# EAGLE schematic schematicEagle (EAGLE 9.6.2)
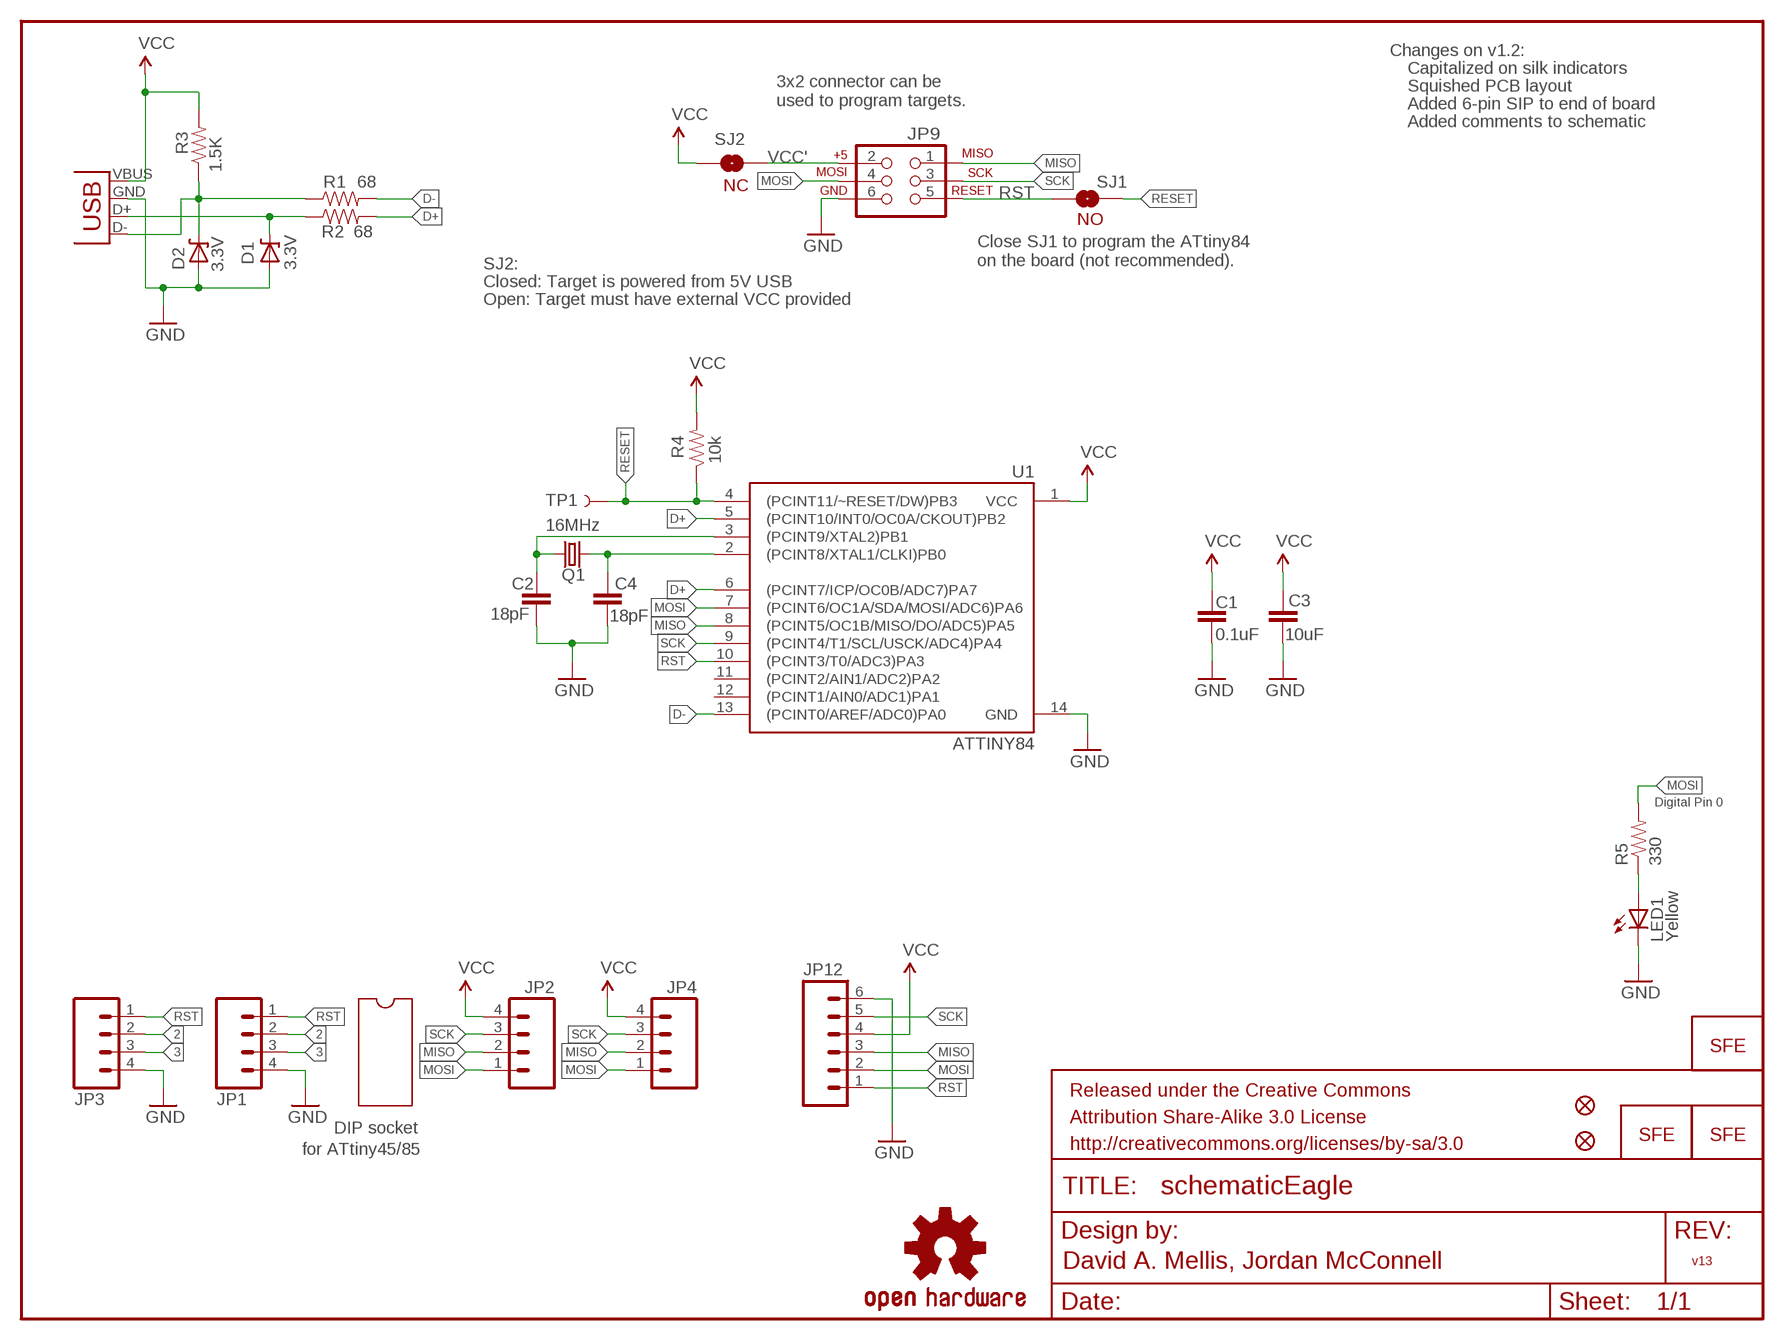
[diagram p0: schematic, sheet 1]

## Parts
C1  0.1uF  CAP0402-CAP  [0402-CAP]
C2  18pF  CAP0402-CAP  [0402-CAP]
C3  10uF  CAP0402-CAP  [0402-CAP]
C4  18pF  CAP0402-CAP  [0402-CAP]
D1  3.3V  DIODE-ZENER-BZT52  [SOD-323]
D2  3.3V  DIODE-ZENER-BZT52  [SOD-323]
FRAME1  FRAME-LETTER  [CREATIVE_COMMONS]
JP1  M04PTH  [1X04]
JP2  M04PTH  [1X04]
JP3  M04SMD_STRAIGHT_COMBO  [1X04_SMD_STRAIGHT_COMBO]
JP4  M04SMD_STRAIGHT_COMBO  [1X04_SMD_STRAIGHT_COMBO]
JP5  LOGO-SFENW2  [SFE-NEW-WEB]
JP6  LOGO-SFESK  [SFE-LOGO-FLAME]
JP7  FIDUCIALUFIDUCIAL  [MICRO-FIDUCIAL]
JP8  FIDUCIALUFIDUCIAL  [MICRO-FIDUCIAL]
JP9  AVR_SPI_PRG_6PTH  [2X3]
JP11  LOGO-SFESK  [SFE-LOGO-FLAME]
JP12  M06SIP  [1X06]
LED1  Yellow  LED0603  [LED-0603]
Q1  16MHz  CRYSTAL5X3  [CRYSTAL-SMD-5X3]
R1  68  RESISTOR0402-RES  [0402-RES]
R2  68  RESISTOR0402-RES  [0402-RES]
R3  1.5K  RESISTOR0402-RES  [0402-RES]
R4  10k  RESISTOR0402-RES  [0402-RES]
R5  330  RESISTOR0402-RES  [0402-RES]
SJ1  SOLDERJUMPERNO  [SJ_2S-NO]
SJ2  NC  SOLDERJUMPERNC  [SJ_2S]
TP1  TEST-POINT3  [PAD.03X.03]
U1  ATTINY84  [SO14]
U$1  OSHW-LOGOS  [OSHW-LOGO-S]
X1  USB-A-H  [USB-A-H]

## Nets
2: JP1.2 JP3.2
3: JP1.3 JP3.3
D+: R2.2 U1.5((PCINT10/INT0/OC0A/CKOUT)PB2) U1.6((PCINT7/ICP/OC0B/ADC7)PA7)
D-: R1.2 U1.13((PCINT0/AREF/ADC0)PA0)
GND: C1.2 C2.2 C3.2 C4.2 D1.2(A) D2.2(A) JP1.4 JP3.4 JP9.6 JP12.6 LED1.C U1.14(GND) X1.GND(VBUS)
MISO: JP2.2 JP4.2 JP9.1 JP12.3 U1.8((PCINT5/OC1B/MISO/DO/ADC5)PA5)
MOSI: JP2.1 JP4.1 JP9.4 JP12.2 R5.2 U1.7((PCINT6/OC1A/SDA/MOSI/ADC6)PA6)
N$1: D2.1(C) R1.1 R3.1 X1.D-(D+)
N$2: D1.1(C) R2.1 X1.D+(D-)
N$3: C2.1 Q1.3 U1.3((PCINT9/XTAL2)PB1)
N$4: C4.1 Q1.1 U1.2((PCINT8/XTAL1/CLKI)PB0)
N$5: LED1.A R5.1
RESET: R4.1 SJ1.1 TP1.P$1 U1.4((PCINT11/~RESET/DW)PB3)
RST: JP1.1 JP3.1 JP9.5 JP12.1 SJ1.2 U1.10((PCINT3/T0/ADC3)PA3)
SCK: JP2.3 JP4.3 JP9.3 JP12.5 U1.9((PCINT4/T1/SCL/USCK/ADC4)PA4)
VCC: C1.1 C3.1 JP2.4 JP4.4 JP12.4 R3.2 R4.2 SJ2.1 U1.1(VCC) X1.VBUS(GND)
VCC': JP9.2 SJ2.2
Unconnected: U1.11((PCINT2/AIN1/ADC2)PA2) U1.12((PCINT1/AIN0/ADC1)PA1)

## Notes on the sheet
- Changes on v1.2:
- Capitalized on silk indicators
- Squished PCB layout
- 3x2 connector can be
  used to program targets.
- Added 6-pin SIP to end of board
- Added comments to schematic
- NC
- NO
- Close SJ1 to program the ATtiny84
  on the board (not recommended).
- SJ2:
- Closed: Target is powered from 5V USB
- Open: Target must have external VCC provided
- Digital Pin 0
- DIP socket
- for ATtiny45/85
- v13
- David A. Mellis, Jordan McConnell

## Library data of the parts
C1-C4 = SparkFun-Passives:CAP: Capacitor Standard 0603 ceramic capacitor, and 0.1" leaded capacitor.
D1 D2 = SparkFun-DiscreteSemi:DIODE-ZENER: Zener Diode Production Part - 8199 3.4V Zener Voltage
FRAME1 = SparkFun-Aesthetics:FRAME-LETTER: Schematic Frame Standard 8.5x11 US Letter frame
JP1-JP4 = SparkFun-Connectors:M04: Header 4 Standard 4-pin 0.1" header. Use with straight break away headers (SKU : PRT-00116), right angle break away headers (PRT-00553), swiss pins (PRT-00743), machine pins (PRT-00117), and female headers (PRT-00115). Molex polarized connector foot print use with SKU : PRT-08231 with associated crimp pins and housings. 1MM SMD Version SKU: PRT-10208
JP5 JP6 JP11 = SparkFun-Aesthetics:LOGO-SFE: Spark Fun Electronics PCB Logo This is the standard Spark Fun Electronics PCB logo.
JP7 JP8 = SparkFun:FIDUCIAL: Fiducial Alignment Points Various fiducial points for machine vision alignment.
JP9 = SparkFun-Connectors:AVR_SPI_PRG_6: AVR ISP 6 Pin This is the reduced ISP connector for AVR programming. Common on Arduino. This footprint will take up less PCB space and can be used with a 10-pin to 6-pin adapter such as SKU: BOB-08508
JP12 = SparkFun-Connectors:M06: Header 6 Standard 6-pin 0.1" header. Use with straight break away headers (SKU : PRT-00116), right angle break away headers (PRT-00553), swiss pins (PRT-00743), machine pins (PRT-00117), and female headers (PRT-00115). Molex polarized connector foot print use with SKU : PRT-08094 with associated crimp pins and housings. NOTES ON THE VARIANTS LOCK and LOCK_LONGPADS... This footprint was designed to help hold the alignment of a through-hole component (i.e. 6-pin header) while soldering it into place. You may notice that each hole has been shifted either up or down by 0.005 of an inch from it's more standard position (which is a perfectly straight line). This slight alteration caused the pins (the squares in the middle) to touch the edges of the holes. Because they are alternating, it causes a "brace" to hold the component in place. 0.005 has proven to be the perfect amount of "off-center" position when using our standard breakaway headers. Although looks a little odd when you look at the bare footprint, once you have a header in there, the alteration is very hard to notice. Also,if you push a header all the way into place, it is covered up entirely on the bottom side. This idea of altering the position of holes to aid alignment will be further integrated into the Sparkfun Library for other footprints. It can help hold any component with 3 or more connection pins.
LED1 = SparkFun-LED:LED: LEDs Standard schematic elements and footprints for 5mm, 3mm, 1206, and 0603 sized LEDs. 5mm - Spark Fun Electronics SKU : COM-00529 (and others)
Q1 = SparkFun-FreqCtrl:CRYSTAL: Various standard crystals. Proven footprints. Spark Fun Electronics SKU : COM-00534
R1-R5 = SparkFun-Passives:RESISTOR: Resistor Basic schematic elements and footprints for 0603, 1206, and PTH resistors.
SJ1 SJ2 = SparkFun-Passives:SOLDERJUMPER: Solder Jumper Standard SMD solder jumper. Used to automate production. Two varients : Normally Open and Normally Closed are the same, but have different paste layers. NC will have a large amount of paste and should jumper during reflow.
TP1 = SparkFun-Passives:TEST-POINT: Bare copper test points for troubleshooting or ICT
U1 = SparkFun-DigitalIC:ATTINY84: Atmel 14-pin 2/4/8kB flash uC
U$1 = SparkFun-Aesthetics:OSHW-LOGO: Open Source Hardware Logo This logo indicates the piece of hardware it is found on incorporates a OSHW license and/or adheres to the definition of open source hardware found here: http://freedomdefined.org/OSHW
X1 = SparkFun-Connectors:USB: USB Connectors USB-B-PTH is fully proven SKU : PRT-00139 USB-miniB is fully proven SKU : PRT-00587 USB-A-PCB is untested. USB-A-H is throughly reviewed, but untested. Spark Fun Electronics SKU : PRT-00437 USB-B-SMT is throughly reviewed, but untested. Needs silkscreen touching up. USB-A-S has not been used/tested USB-MB-H has not been used/tested